# Altium schematic sheet Final_PCBDesign_HY.SchDoc
size A4; SheetNumber: 1; SheetTotal: 1
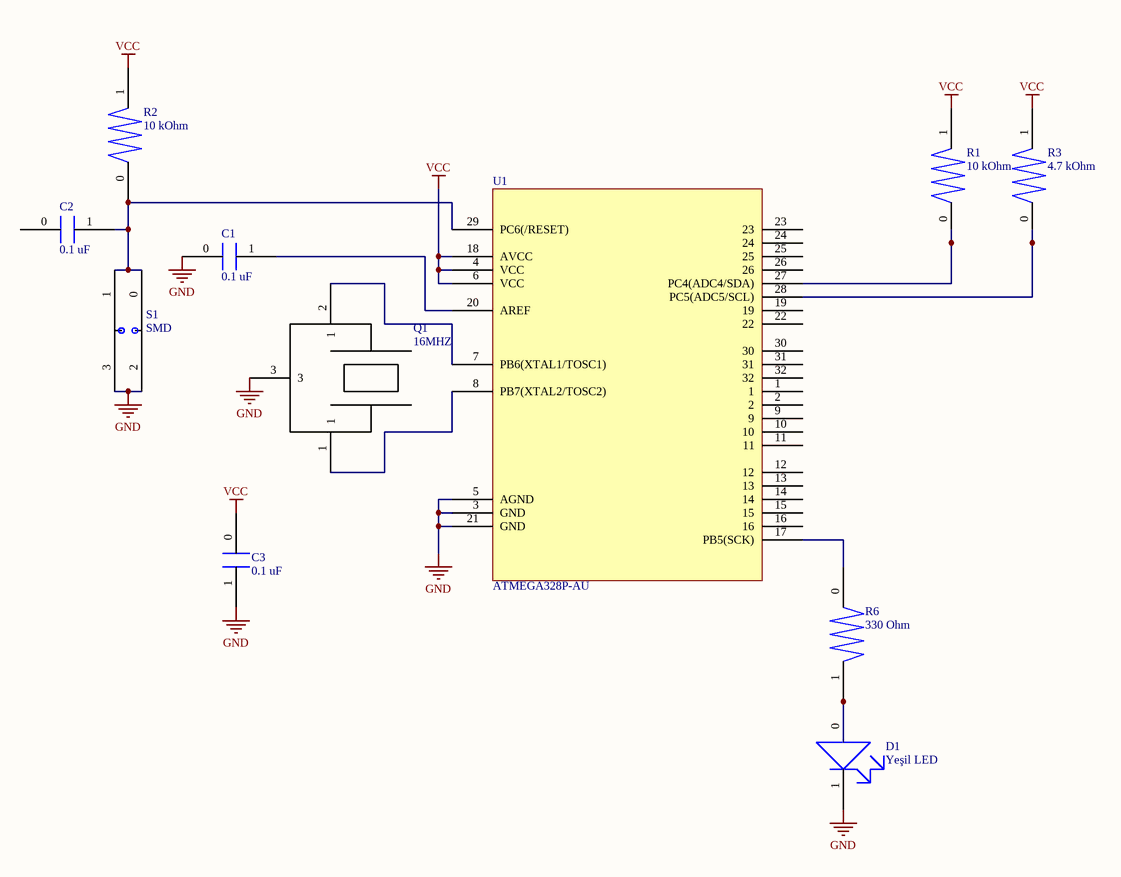
[diagram p0: Final_PCBDesign_HY.SchDoc]

## Parts
C1  0.1 uF  [C_0603 (1608 Metric)]
C2  0.1 uF  [C_0603 (1608 Metric)]
C3  0.1 uF  [C_0603 (1608 Metric)]
D1  Yeşil LED  [D_0603 (1608 Metric)]
Q1  16MHZ  [Q_3-SMD]
R1  10 kOhm  [R_0603]
R2  10 kOhm  [R_0603]
R3  4.7 kOhm  [0603 (1608 Metric)_2]
R6  330 Ohm  [R_0603 (1608 Metric)]
S1  SMD  [EVQ-P7L01P]
U1  ATMEGA328P-AU  [U_32-TQFP]

## Nets
GND: C1.0 C3.1 D1.1 Q1.3 S1.2 S1.3 U1.3(GND) U1.5(AGND) U1.21(GND)
VCC: C3.0 R1.1 R2.1 R3.1 U1.4(VCC) U1.6(VCC) U1.18(AVCC)
NetC1_1: C1.1 U1.20(AREF)
NetC2_1: C2.1 R2.0 S1.0 S1.1 U1.29(PC6(/RESET))
NetD1_0: D1.0 R6.1
NetQ1_1: Q1.1 U1.8(PB7(XTAL2/TOSC2))
NetQ1_2: Q1.2(1) U1.7(PB6(XTAL1/TOSC1))
NetR1_0: R1.0 U1.27(PC4(ADC4/SDA))
NetR3_0: R3.0 U1.28(PC5(ADC5/SCL))
NetR6_0: R6.0 U1.17(PB5(SCK))

Not connected (* = marked no-connect by the designer): C2 0; U1 1 2 9 10 11 12 13 14 15 16 19 22 23 24 25 26 30 31 32

## Library data of the parts
C1-C3 = CL10B104KB8NNNC: Multi Layer Ceramic Capacitor (MLCC) / Cap Ceramic 0.1uF 50V X7R 10% Pad SMD 0603 125°C T/R; Manufacturer: Samsung Electro-Mechanics; Value: 100nF; Supplier: Future Electronics; Supplier Part Number: CL10B104KB8NNNC; Manufacturer Part Number: CL10B104KB8NNNC; RoHS: Compliant; Category: Ceramic Capacitors; Stock: 68984000; Pricing: 8000=0,0023, 20000=0,0022, 80000=0,0021, 200000=0,0021, 500000=0,002 (USD); Case/Package: 0603; Case Code (Imperial): 0603; Case Code (Metric): 1608; China RoHS: Compliant; Contact Plating: Tin; Depth: 800µm; Dielectric: X7R; Dielectric Material: Ceramic; Height: 900µm; Lead Free: Lead Free; Length: 1.6mm; Lifecycle Status: Production; Material: Ceramic; Max Operating Temperature: 125°C; Min Operating Temperature: -55°C; Mounting Technology: Surface Mount; Number of Terminals: 2; Radiation Hardening: No; REACH SVHC: Yes; Schedule B: 8532240020, 8532240020|8532240020|8532240020|8532240020|8532240020|8532240020|8532240020|8532240020|8532240020|8532240020, 8532240020|8532240020|8532240020|8532240020|8532240020|8532240020|8532240020|8532240020|8532240020|8532240020|8532240020, 8532240020|8532240020|8532240020|8532240020|8532240020|8532240020|8532240020|8532240020|8532240020|8532240020|8532240020|8532240020; Thickness: 889µm; Tolerance: 10%; Voltage: 50V; Voltage Rating: 50V; Voltage Rating (DC): 50V; Width: 800µm; ComponentLink1URL: https://datasheet.octopart.com:443/CL10B104KB8NNNC-Samsung-datasheet-165517828.pdf?src-supplier=Upverter; ComponentLink1Description: https://datasheet.octopart.com:443/CL10B104KB8NNNC-Samsung-datasheet-165517828.pdf?src-supplier=Upverter; ComponentLink2URL: https://datasheet.octopart.com:443/CL10B104KB8NNNC-Samsung-Electro-Mechanics-datasheet-116890969.pdf?src-supplier=Upverter; ComponentLink2Description: https://datasheet.octopart.com:443/CL10B104KB8NNNC-Samsung-Electro-Mechanics-datasheet-116890969.pdf?src-supplier=Upverter; ComponentLink3URL: https://datasheet.octopart.com:443/CL10B104KB8NNNC-Samsung-Electro-Mechanics-datasheet-81461840.pdf?src-supplier=Upverter; ComponentLink3Description: https://datasheet.octopart.com:443/CL10B104KB8NNNC-Samsung-Electro-Mechanics-datasheet-81461840.pdf?src-supplier=Upverter; ComponentLink4URL: https://datasheet.octopart.com:443/CL10B104KB8NNNC-Samsung-Electro-Mechanics-datasheet-181551448.pdf?src-supplier=Newark; ComponentLink4Description: https://datasheet.octopart.com:443/CL10B104KB8NNNC-Samsung-Electro-Mechanics-datasheet-181551448.pdf?src-supplier=Newark; ComponentLink5URL: https://datasheet.octopart.com:443/CL10B104KB8NNNC-Samsung-Electro-Mechanics-datasheet-181551449.pdf?src-supplier=Newark; ComponentLink5Description: https://datasheet.octopart.com:443/CL10B104KB8NNNC-Samsung-Electro-Mechanics-datasheet-181551449.pdf?src-supplier=Newark; ComponentLink6URL: https://datasheet.octopart.com/CL10B104KB8NNNC-Samsung-Electro-Mechanics-datasheet-8324245.pdf; ComponentLink6Description: https://datasheet.octopart.com/CL10B104KB8NNNC-Samsung-Electro-Mechanics-datasheet-8324245.pdf; ComponentLink7URL: https://datasheet.octopart.com/CL10B104KB8NNNC-Samsung-Electro-Mechanics-datasheet-97040617.pdf; ComponentLink7Description: https://datasheet.octopart.com/CL10B104KB8NNNC-Samsung-Electro-Mechanics-datasheet-97040617.pdf; ComponentLink8URL: https://datasheet.octopart.com:443/CL10B104KB8NNNC-Samsung-Electro-Mechanics-datasheet-136482302.pdf?src-supplier=Samsung+SCT; ComponentLink8Description: https://datasheet.octopart.com:443/CL10B104KB8NNNC-Samsung-Electro-Mechanics-datasheet-136482302.pdf?src-supplier=Samsung+SCT; ComponentLink9URL: https://datasheet.octopart.com:443/CL10B104KB8NNNC-Samsung-datasheet-42770373.pdf?src-supplier=Future+Electronics; ComponentLink9Description: https://datasheet.octopart.com:443/CL10B104KB8NNNC-Samsung-datasheet-42770373.pdf?src-supplier=Future+Electronics; ComponentLink10URL: https://datasheet.octopart.com:443/CL10B104KB8NNNC-Samsung-datasheet-26589154.pdf?src-supplier=Future+Electronics; ComponentLink10Description: https://datasheet.octopart.com:443/CL10B104KB8NNNC-Samsung-datasheet-26589154.pdf?src-supplier=Future+Electronics; ComponentLink11URL: https://datasheet.octopart.com:443/CL10B104KB8NNNC-Samsung-Electro-Mechanics-datasheet-149136784.pdf?src-supplier=Future+Electronics; ComponentLink11Description: https://datasheet.octopart.com:443/CL10B104KB8NNNC-Samsung-Electro-Mechanics-datasheet-149136784.pdf?src-supplier=Future+Electronics; ComponentLink12URL: https://datasheet.octopart.com:443/CL10B104KB8NNNC-Samsung-datasheet-22147433.pdf?src-supplier=TME; ComponentLink12Description: https://datasheet.octopart.com:443/CL10B104KB8NNNC-Samsung-datasheet-22147433.pdf?src-supplier=TME; ComponentLink13URL: https://datasheet.octopart.com:443/CL10B104KB8NNNC-Samsung-Electro-Mechanics-datasheet-11837008.pdf?src-supplier=Arrow+Electronics; ComponentLink13Description: https://datasheet.octopart.com:443/CL10B104KB8NNNC-Samsung-Electro-Mechanics-datasheet-11837008.pdf?src-supplier=Arrow+Electronics
D1 = LTST-C190KGKT: LED yellow green 0603 wavelength 567.5nm~576.5nm light intensity 18mcd~71mcd Front Mounting; Manufacturer: Diodes Inc.; Dominant Wavelength: 571nm; Forward Current: 30mA; Forward Voltage: 2.4V; Lens Color: Clear, Colorless; Lens Style: Clear; Luminous Intensity: 35mcd; Number of Circuits: 1; Peak Wavelength: 574nm; Power Dissipation: 75mW; Reverse Voltage: 5V; Shape: Rectangular; Test Current: 20mA; Viewing Angle: 130°; Supplier: Arrow Electronics; Supplier Part Number: LTST-C190KGKT; Manufacturer Part Number: LTST-C190KGKT; RoHS: Compliant; Category: LEDs; Stock: 508000; Pricing: 4000=0,0157, 8000=0,0153, 12000=0,0151, 20000=0,0148, 28000=0,0146, 40000=0,0144 (USD); Case/Package: 0603; Case Code (Imperial): 0603; Case Code (Metric): 1608; China RoHS: Compliant; Color: Green; Depth: 800µm; Height: 800µm; Illumination Color: Green; Lead Free: Lead Free; Length: 1.6mm; Lens Transparency: Clear; Lifecycle Status: Production; Max Operating Temperature: 85°C; Min Operating Temperature: -30°C; Mounting Technology: Surface Mount; Number of Elements: 1; Number of LEDs: 1; Pins: 2; Number of Terminals: 2; Power Rating: 75mW; Radiation Hardening: No; REACH SVHC: Yes; Schedule B: 8541402000, 8541402000|8541402000|8541402000|8541402000|8541402000|8541402000|8541402000|8541402000|8541402000|8541402000|8541402000|8541402000|8541402000|8541402000|8541402000|8541402000|8541402000|8541402000|8541402000|8541402000|8541402000|8541402000|8541402000|85; Terminal Pitch: 1.5mm; Wavelength: 574nm; Width: 800µm; ComponentLink1URL: https://datasheet.octopart.com:443/LTST-C190KGKT-Lite-On-datasheet-86397316.pdf?src-supplier=ODG+(Origin+Data+Global); ComponentLink1Description: https://datasheet.octopart.com:443/LTST-C190KGKT-Lite-On-datasheet-86397316.pdf?src-supplier=ODG+(Origin+Data+Global); ComponentLink2URL: https://datasheet.octopart.com:443/LTST-C190KGKT-Lite-On-datasheet-180605179.pdf?src-supplier=IHS; ComponentLink2Description: https://datasheet.octopart.com:443/LTST-C190KGKT-Lite-On-datasheet-180605179.pdf?src-supplier=IHS; ComponentLink3URL: https://datasheet.octopart.com:443/LTST-C190KGKT-Lite-On-datasheet-13693967.pdf?src-supplier=Factory+Futures; ComponentLink3Description: https://datasheet.octopart.com:443/LTST-C190KGKT-Lite-On-datasheet-13693967.pdf?src-supplier=Factory+Futures; ComponentLink4URL: https://datasheet.octopart.com:443/LTST-C190KGKT-Lite-On-datasheet-165573809.pdf?src-supplier=TME; ComponentLink4Description: https://datasheet.octopart.com:443/LTST-C190KGKT-Lite-On-datasheet-165573809.pdf?src-supplier=TME; ComponentLink5URL: https://datasheet.octopart.com:443/LTST-C190KGKT-Lite-On-datasheet-165573808.pdf?src-supplier=TME; ComponentLink5Description: https://datasheet.octopart.com:443/LTST-C190KGKT-Lite-On-datasheet-165573808.pdf?src-supplier=TME; ComponentLink6URL: https://datasheet.octopart.com:443/LTST-C190KGKT-Lite-On-datasheet-43775815.pdf?src-supplier=TME; ComponentLink6Description: https://datasheet.octopart.com:443/LTST-C190KGKT-Lite-On-datasheet-43775815.pdf?src-supplier=TME; ComponentLink7URL: https://datasheet.octopart.com:443/LTST-C190KGKT-Lite-On-datasheet-32046999.pdf?src-supplier=Future+Electronics; ComponentLink7Description: https://datasheet.octopart.com:443/LTST-C190KGKT-Lite-On-datasheet-32046999.pdf?src-supplier=Future+Electronics; ComponentLink8URL: https://datasheet.octopart.com:443/LTST-C190KGKT-Lite-On-datasheet-8326678.pdf?src-supplier=Future+Electronics; ComponentLink8Description: https://datasheet.octopart.com:443/LTST-C190KGKT-Lite-On-datasheet-8326678.pdf?src-supplier=Future+Electronics; ComponentLink9URL: https://datasheet.octopart.com:443/LTST-C190KGKT-Lite-On-datasheet-78838574.pdf?src-supplier=Future+Electronics; ComponentLink9Description: https://datasheet.octopart.com:443/LTST-C190KGKT-Lite-On-datasheet-78838574.pdf?src-supplier=Future+Electronics; ComponentLink10URL: https://datasheet.octopart.com:443/LTST-C190KGKT-Lite-On-datasheet-158288.pdf?src-supplier=Mouser; ComponentLink10Description: https://datasheet.octopart.com:443/LTST-C190KGKT-Lite-On-datasheet-158288.pdf?src-supplier=Mouser; ComponentLink11URL: https://datasheet.octopart.com:443/LTST-C190KGKT-Lite-On-datasheet-49281.pdf?src-supplier=DigiKey; ComponentLink11Description: https://datasheet.octopart.com:443/LTST-C190KGKT-Lite-On-datasheet-49281.pdf?src-supplier=DigiKey; ComponentLink12URL: https://datasheet.octopart.com:443/LTST-C190KGKT-Lite-On-datasheet-14174998.pdf?src-supplier=iiiC; ComponentLink12Description: https://datasheet.octopart.com:443/LTST-C190KGKT-Lite-On-datasheet-14174998.pdf?src-supplier=iiiC
Q1 = CSTCE16M0V53-R0: Ceramic Resonator 16MHz ±0.5% (Tol) ±0.3% (Stability) 15pF 40Ohm 3-Pin CSMD T/R; Manufacturer: Murata; Frequency Stability: 5000ppm; Impedance: 40Ω; Supplier: Farnell; Supplier Part Number: CSTCE16M0V53-R0; Manufacturer Part Number: CSTCE16M0V53-R0; RoHS: Compliant; Category: Capacitors; Pricing: 5=0,458, 50=0,304, 250=0,277, 500=0,227, 1500=0,212, 3000=0,197, 15000=0,191 (EUR); Value: 15pF; Case/Package: SMD/SMT; Composition: Ceramic; Contact Plating: Gold; Frequency: 16MHz; Frequency Tolerance: 0.5%; Height: 990.6µm; Lead Free: Lead Free; Length: 3.2004mm; Lifecycle Status: Obsolete; Load Capacitance: 15pF; Max Operating Temperature: 85°C; Min Operating Temperature: -45°C; Pins: 3; REACH SVHC: Yes; Self Resonant Frequency: 16MHz; Termination: SMD/SMT; Tolerance: 0.5%; Width: 1.2954mm; ComponentLink1URL: https://datasheet.octopart.com:443/CSTCE16M0V53-R0-Murata-datasheet-180807744.pdf?src-supplier=IHS; ComponentLink1Description: https://datasheet.octopart.com:443/CSTCE16M0V53-R0-Murata-datasheet-180807744.pdf?src-supplier=IHS; ComponentLink2URL: https://datasheet.octopart.com:443/CSTCE16M0V53-R0-Murata-datasheet-13544362.pdf?src-supplier=Upverter; ComponentLink2Description: https://datasheet.octopart.com:443/CSTCE16M0V53-R0-Murata-datasheet-13544362.pdf?src-supplier=Upverter; ComponentLink3URL: https://datasheet.octopart.com:443/CSTCE16M0V53-R0-Murata-datasheet-12524911.pdf?src-supplier=Upverter; ComponentLink3Description: https://datasheet.octopart.com:443/CSTCE16M0V53-R0-Murata-datasheet-12524911.pdf?src-supplier=Upverter; ComponentLink4URL: https://datasheet.octopart.com:443/CSTCE16M0V53-R0-Murata-datasheet-62316101.pdf?src-supplier=Upverter; ComponentLink4Description: https://datasheet.octopart.com:443/CSTCE16M0V53-R0-Murata-datasheet-62316101.pdf?src-supplier=Upverter; ComponentLink5URL: https://datasheet.octopart.com:443/CSTCE16M0V53-R0-Murata-datasheet-141913778.pdf?src-supplier=Upverter; ComponentLink5Description: https://datasheet.octopart.com:443/CSTCE16M0V53-R0-Murata-datasheet-141913778.pdf?src-supplier=Upverter; ComponentLink6URL: https://datasheet.octopart.com:443/CSTCE16M0V53-R0-Murata-datasheet-5335552.pdf?src-supplier=Newark; ComponentLink6Description: https://datasheet.octopart.com:443/CSTCE16M0V53-R0-Murata-datasheet-5335552.pdf?src-supplier=Newark; ComponentLink7URL: https://datasheet.octopart.com:443/CSTCE16M0V53-R0-Murata-datasheet-162930.pdf?src-supplier=Future+Electronics; ComponentLink7Description: https://datasheet.octopart.com:443/CSTCE16M0V53-R0-Murata-datasheet-162930.pdf?src-supplier=Future+Electronics; ComponentLink8URL: https://datasheet.octopart.com:443/CSTCE16M0V53-R0-Murata-datasheet-10541638.pdf?src-supplier=Future+Electronics; ComponentLink8Description: https://datasheet.octopart.com:443/CSTCE16M0V53-R0-Murata-datasheet-10541638.pdf?src-supplier=Future+Electronics; ComponentLink9URL: https://datasheet.octopart.com:443/CSTCE16M0V53-R0-Murata-datasheet-141258340.pdf?src-supplier=Ciiva; ComponentLink9Description: https://datasheet.octopart.com:443/CSTCE16M0V53-R0-Murata-datasheet-141258340.pdf?src-supplier=Ciiva; ComponentLink10URL: https://datasheet.octopart.com:443/CSTCE16M0V53-R0-Murata-datasheet-138707999.pdf?src-supplier=Ciiva; ComponentLink10Description: https://datasheet.octopart.com:443/CSTCE16M0V53-R0-Murata-datasheet-138707999.pdf?src-supplier=Ciiva; ComponentLink11URL: https://datasheet.octopart.com:443/CSTCE16M0V53-R0-Murata-datasheet-83054217.pdf?src-supplier=TME; ComponentLink11Description: https://datasheet.octopart.com:443/CSTCE16M0V53-R0-Murata-datasheet-83054217.pdf?src-supplier=TME; ComponentLink12URL: https://datasheet.octopart.com/CSTCE16M0V53-R0-Murata-datasheet-86813623.pdf; ComponentLink12Description: https://datasheet.octopart.com/CSTCE16M0V53-R0-Murata-datasheet-86813623.pdf; ComponentLink13URL: https://datasheet.octopart.com:443/CSTCE16M0V53-R0-Murata-datasheet-13536434.pdf?src-supplier=Factory+Futures; ComponentLink13Description: https://datasheet.octopart.com:443/CSTCE16M0V53-R0-Murata-datasheet-13536434.pdf?src-supplier=Factory+Futures; ComponentLink14URL: https://datasheet.octopart.com:443/CSTCE16M0V53-R0-Murata-datasheet-11793933.pdf?src-supplier=Arrow+Electronics; ComponentLink14Description: https://datasheet.octopart.com:443/CSTCE16M0V53-R0-Murata-datasheet-11793933.pdf?src-supplier=Arrow+Electronics; ComponentLink15URL: https://datasheet.octopart.com:443/CSTCE16M0V53-R0-Murata-datasheet-15574.pdf?src-supplier=element14+APAC; ComponentLink15Description: https://datasheet.octopart.com:443/CSTCE16M0V53-R0-Murata-datasheet-15574.pdf?src-supplier=element14+APAC; ComponentLink16URL: https://datasheet.octopart.com:443/CSTCE16M0V53-R0-Murata-datasheet-119166.pdf?src-supplier=DigiKey; ComponentLink16Description: https://datasheet.octopart.com:443/CSTCE16M0V53-R0-Murata-datasheet-119166.pdf?src-supplier=DigiKey; ComponentLink17URL: http://sigma.octopart.com:80/reach_statement/Murata-company-16.pdf?src-supplier=Compliance+Statements; ComponentLink17Description: http://sigma.octopart.com:80/reach_statement/Murata-company-16.pdf?src-supplier=Compliance+Statements
R1 R2 = RC0603FR-0710KL: 100mW Thick Film Resistors ±100ppm/℃ ±1% 10kΩ 0603 Chip Resistor - Surface Mount ROHS; Manufacturer: Yageo Group; Temperature Coefficient: 100ppm/°C; Voltage Rating: 75V; Voltage Rating (DC): 50V; Supplier: Farnell; Supplier Part Number: RC0603FR-0710KL; Manufacturer Part Number: RC0603FR-0710KL; RoHS: Compliant; Category: Chip SMD Resistors; Stock: 11228000; Pricing: 5000=0,0037 (EUR); Case/Package: 0603; Case Code (Imperial): 0603; Case Code (Metric): 0603; China RoHS: Non-Compliant; Composition: Thick Film; Contact Plating: Tin; Depth: 800µm; Height: 450µm; Lead Free: Lead Free; Lead Pitch: 300µm; Length: 1.6mm; Lifecycle Status: Production; Max Operating Temperature: 155°C; Military Standard: Not; Min Operating Temperature: -55°C; Mounting Technology: Surface Mount; Pins: 2; Number of Terminals: 2; Packaging: Tape & Reel; Power Rating: 100mW; Radiation Hardening: No; REACH SVHC: Yes; Value: 10kΩ; Schedule B: 8533210045, 8533210045|8533210045|8533210045|8533210045|8533210045|8533210045|8533210045|8533210045|8533210045|8533210045|8533210045|8533210045|8533210045|8533210045|8533210045|8533210045|8533210045|8533210045|8533210045|8533210045|8533210045|8533210045|8533210045|85; Termination: SMD/SMT; Tolerance: 1%; Weight: 2.012816mg; Width: 800µm; Working Voltage: 75V; ComponentLink1URL: https://datasheet.octopart.com:443/RC0603FR-0710KL-Yageo-datasheet-175887523.pdf?src-supplier=IHS; ComponentLink1Description: https://datasheet.octopart.com:443/RC0603FR-0710KL-Yageo-datasheet-175887523.pdf?src-supplier=IHS; ComponentLink2URL: https://datasheet.octopart.com:443/RC0603FR-0710KL-Yageo-datasheet-103092701.pdf?src-supplier=Upverter; ComponentLink2Description: https://datasheet.octopart.com:443/RC0603FR-0710KL-Yageo-datasheet-103092701.pdf?src-supplier=Upverter; ComponentLink3URL: https://datasheet.octopart.com:443/RC0603FR-0710KL-Yageo-datasheet-98239111.pdf?src-supplier=Upverter; ComponentLink3Description: https://datasheet.octopart.com:443/RC0603FR-0710KL-Yageo-datasheet-98239111.pdf?src-supplier=Upverter; ComponentLink4URL: https://datasheet.octopart.com:443/RC0603FR-0710KL-Yageo-datasheet-141265859.pdf?src-supplier=Upverter; ComponentLink4Description: https://datasheet.octopart.com:443/RC0603FR-0710KL-Yageo-datasheet-141265859.pdf?src-supplier=Upverter; ComponentLink5URL: https://sigma.octopart.com:443/138820526/technical_drawing/Yageo-RC0603FR-0710KL.pdf?src-supplier=Upverter; ComponentLink5Description: https://sigma.octopart.com:443/138820526/technical_drawing/Yageo-RC0603FR-0710KL.pdf?src-supplier=Upverter; ComponentLink6URL: https://datasheet.octopart.com:443/RC0603FR-0710KL-Yageo-datasheet-8328172.pdf?src-supplier=Farnell; ComponentLink6Description: https://datasheet.octopart.com:443/RC0603FR-0710KL-Yageo-datasheet-8328172.pdf?src-supplier=Farnell; ComponentLink7URL: https://datasheet.octopart.com:443/RC0603FR-0710KL-Yageo-datasheet-13691069.pdf?src-supplier=Farnell; ComponentLink7Description: https://datasheet.octopart.com:443/RC0603FR-0710KL-Yageo-datasheet-13691069.pdf?src-supplier=Farnell; ComponentLink8URL: https://datasheet.octopart.com:443/RC0603FR-0710KL-Yageo-datasheet-62067350.pdf?src-supplier=element14+APAC; ComponentLink8Description: https://datasheet.octopart.com:443/RC0603FR-0710KL-Yageo-datasheet-62067350.pdf?src-supplier=element14+APAC; ComponentLink9URL: https://datasheet.octopart.com:443/RC0603FR-0710KL-Yageo-datasheet-17842380.pdf?src-supplier=element14+APAC; ComponentLink9Description: https://datasheet.octopart.com:443/RC0603FR-0710KL-Yageo-datasheet-17842380.pdf?src-supplier=element14+APAC; ComponentLink10URL: https://datasheet.octopart.com:443/RC0603FR-0710KL-Yageo-datasheet-15599030.pdf?src-supplier=Future+Electronics; ComponentLink10Description: https://datasheet.octopart.com:443/RC0603FR-0710KL-Yageo-datasheet-15599030.pdf?src-supplier=Future+Electronics; ComponentLink11URL: https://datasheet.octopart.com:443/RC0603FR-0710KL-Yageo-Group-datasheet-176638170.pdf?src-supplier=Future+Electronics; ComponentLink11Description: https://datasheet.octopart.com:443/RC0603FR-0710KL-Yageo-Group-datasheet-176638170.pdf?src-supplier=Future+Electronics; ComponentLink12URL: https://datasheet.octopart.com:443/RC0603FR-0710KL-Yageo-datasheet-164759695.pdf?src-supplier=Future+Electronics; ComponentLink12Description: https://datasheet.octopart.com:443/RC0603FR-0710KL-Yageo-datasheet-164759695.pdf?src-supplier=Future+Electronics; ComponentLink13URL: https://datasheet.octopart.com:443/RC0603FR-0710KL-Yageo-datasheet-127823281.pdf?src-supplier=Future+Electronics; ComponentLink13Description: https://datasheet.octopart.com:443/RC0603FR-0710KL-Yageo-datasheet-127823281.pdf?src-supplier=Future+Electronics; ComponentLink14URL: https://datasheet.octopart.com:443/RC0603FR-0710KL-Yageo-datasheet-137700087.pdf?src-supplier=Future+Electronics; ComponentLink14Description: https://datasheet.octopart.com:443/RC0603FR-0710KL-Yageo-datasheet-137700087.pdf?src-supplier=Future+Electronics; ComponentLink15URL: https://datasheet.octopart.com:443/RC0603FR-0710KL-Yageo-datasheet-27584510.pdf?src-supplier=Future+Electronics; ComponentLink15Description: https://datasheet.octopart.com:443/RC0603FR-0710KL-Yageo-datasheet-27584510.pdf?src-supplier=Future+Electronics; ComponentLink16URL: https://datasheet.octopart.com:443/RC0603FR-0710KL-Yageo-datasheet-8324193.pdf?src-supplier=Future+Electronics; ComponentLink16Description: https://datasheet.octopart.com:443/RC0603FR-0710KL-Yageo-datasheet-8324193.pdf?src-supplier=Future+Electronics; ComponentLink17URL: https://datasheet.octopart.com:443/RC0603FR-0710KL-Yageo-datasheet-12596169.pdf?src-supplier=Newark; ComponentLink17Description: https://datasheet.octopart.com:443/RC0603FR-0710KL-Yageo-datasheet-12596169.pdf?src-supplier=Newark; ComponentLink18URL: https://datasheet.octopart.com:443/RC0603FR-0710KL-Yageo-datasheet-503470.pdf?src-supplier=Newark; ComponentLink18Description: https://datasheet.octopart.com:443/RC0603FR-0710KL-Yageo-datasheet-503470.pdf?src-supplier=Newark; ComponentLink19URL: https://datasheet.octopart.com:443/RC0603FR-0710KL-Yageo-datasheet-34211833.pdf?src-supplier=Newark; ComponentLink19Description: https://datasheet.octopart.com:443/RC0603FR-0710KL-Yageo-datasheet-34211833.pdf?src-supplier=Newark; ComponentLink20URL: https://datasheet.octopart.com:443/RC0603FR-0710KL-Yageo-datasheet-79472498.pdf?src-supplier=Megastar; ComponentLink20Description: https://datasheet.octopart.com:443/RC0603FR-0710KL-Yageo-datasheet-79472498.pdf?src-supplier=Megastar; ComponentLink21URL: https://datasheet.octopart.com/RC0603FR-0710KL-Yageo-datasheet-73766026.pdf; ComponentLink21Description: https://datasheet.octopart.com/RC0603FR-0710KL-Yageo-datasheet-73766026.pdf; ComponentLink22URL: https://datasheet.octopart.com:443/RC0603FR-0710KL-Yageo-datasheet-118562.pdf?src-supplier=DigiKey; ComponentLink22Description: https://datasheet.octopart.com:443/RC0603FR-0710KL-Yageo-datasheet-118562.pdf?src-supplier=DigiKey; ComponentLink23URL: http://sigma.octopart.com:80/conflict_mineral_statement/Yageo-company-3.pdf?src-supplier=Compliance+Statements; ComponentLink23Description: http://sigma.octopart.com:80/conflict_mineral_statement/Yageo-company-3.pdf?src-supplier=Compliance+Statements; ComponentLink24URL: http://sigma.octopart.com:80/rohs_statement/Yageo-company-2.pdf?src-supplier=Compliance+Statements; ComponentLink24Description: http://sigma.octopart.com:80/rohs_statement/Yageo-company-2.pdf?src-supplier=Compliance+Statements
R3 = RC0603FR-074K7L: Yageo RC0603FR-074K7L Resistor 0603 SMD 4.7k Ohm 1% 100mW Thick Film; Manufacturer: Yageo Group; Value: 4.7kΩ; Temperature Coefficient: 100ppm/°C; Voltage Rating: 75V; Voltage Rating (DC): 50V; Supplier: Farnell; Supplier Part Number: RC0603FR-074K7L; Manufacturer Part Number: RC0603FR-074K7L; RoHS: Compliant; Category: Chip SMD Resistors; Stock: 357436; Pricing: 10=0,0058, 100=0,0052, 500=0,0047, 1000=0,0042, 2500=0,0036, 5000=0,0031 (EUR); Case/Package: 0603; Case Code (Imperial): 0603; China RoHS: Non-Compliant; Composition: Thick Film; Contact Plating: Tin; Country of Origin: Mainland China, Taiwan; Depth: 800µm; Export Control Classification Number (ECCN) Code: EAR99; Height: 450µm; Harmonized Tariff Schedule (HTS) Code: 8533.21.00.30; Introduction Date: 2004-09-22; Lead Free: Lead Free; Lead Pitch: 300µm; Length: 1.6mm; Lifecycle Status: Production; Max Operating Temperature: 155°C; Military Standard: Not; Min Operating Temperature: -55°C; Mounting Technology: Surface Mount; Pins: 2; Number of Terminals: 2; Packaging: Tape & Reel; Power Rating: 100mW; Radiation Hardening: No; REACH SVHC: Yes; Schedule B: 8533210045, 8533210045|8533210045|8533210045|8533210045|8533210045|8533210045|8533210045|8533210045|8533210045|8533210045|8533210045|8533210045|8533210045|8533210045|8533210045|8533210045|8533210045|8533210045|8533210045|8533210045|8533210045|8533210045|8533210045|85; Termination: SMD/SMT; Tolerance: 1%; Width: 800µm; Working Voltage: 75V; ComponentLink1URL: https://datasheet.octopart.com:443/RC0603FR-074K7L-Yageo-datasheet-175887523.pdf?src-supplier=IHS; ComponentLink1Description: https://datasheet.octopart.com:443/RC0603FR-074K7L-Yageo-datasheet-175887523.pdf?src-supplier=IHS; ComponentLink2URL: https://datasheet.octopart.com:443/RC0603FR-074K7L-Yageo-datasheet-103092701.pdf?src-supplier=Upverter; ComponentLink2Description: https://datasheet.octopart.com:443/RC0603FR-074K7L-Yageo-datasheet-103092701.pdf?src-supplier=Upverter; ComponentLink3URL: https://datasheet.octopart.com:443/RC0603FR-074K7L-Yageo-datasheet-8328172.pdf?src-supplier=Farnell; ComponentLink3Description: https://datasheet.octopart.com:443/RC0603FR-074K7L-Yageo-datasheet-8328172.pdf?src-supplier=Farnell; ComponentLink4URL: https://datasheet.octopart.com:443/RC0603FR-074K7L-Yageo-datasheet-13691069.pdf?src-supplier=Farnell; ComponentLink4Description: https://datasheet.octopart.com:443/RC0603FR-074K7L-Yageo-datasheet-13691069.pdf?src-supplier=Farnell; ComponentLink5URL: https://datasheet.octopart.com:443/RC0603FR-074K7L-Yageo-Group-datasheet-190305687.pdf?src-supplier=Future+Electronics; ComponentLink5Description: https://datasheet.octopart.com:443/RC0603FR-074K7L-Yageo-Group-datasheet-190305687.pdf?src-supplier=Future+Electronics; ComponentLink6URL: https://datasheet.octopart.com:443/RC0603FR-074K7L-Yageo-datasheet-164759695.pdf?src-supplier=Future+Electronics; ComponentLink6Description: https://datasheet.octopart.com:443/RC0603FR-074K7L-Yageo-datasheet-164759695.pdf?src-supplier=Future+Electronics; ComponentLink7URL: https://datasheet.octopart.com:443/RC0603FR-074K7L-Yageo-datasheet-137700087.pdf?src-supplier=Future+Electronics; ComponentLink7Description: https://datasheet.octopart.com:443/RC0603FR-074K7L-Yageo-datasheet-137700087.pdf?src-supplier=Future+Electronics; ComponentLink8URL: https://datasheet.octopart.com:443/RC0603FR074K7L-Yageo-datasheet-27584510.pdf?src-supplier=Future+Electronics; ComponentLink8Description: https://datasheet.octopart.com:443/RC0603FR074K7L-Yageo-datasheet-27584510.pdf?src-supplier=Future+Electronics; ComponentLink9URL: https://datasheet.octopart.com:443/RC0603FR-074K7L-Yageo-datasheet-15599030.pdf?src-supplier=Future+Electronics; ComponentLink9Description: https://datasheet.octopart.com:443/RC0603FR-074K7L-Yageo-datasheet-15599030.pdf?src-supplier=Future+Electronics; ComponentLink10URL: https://datasheet.octopart.com:443/RC0603FR-074K7L-Yageo-datasheet-175423674.pdf?src-supplier=Newark; ComponentLink10Description: https://datasheet.octopart.com:443/RC0603FR-074K7L-Yageo-datasheet-175423674.pdf?src-supplier=Newark; ComponentLink11URL: https://datasheet.octopart.com:443/RC0603FR-074K7L-Yageo-datasheet-12596169.pdf?src-supplier=Newark; ComponentLink11Description: https://datasheet.octopart.com:443/RC0603FR-074K7L-Yageo-datasheet-12596169.pdf?src-supplier=Newark; ComponentLink12URL: https://datasheet.octopart.com:443/RC0603FR-074K7L-Yageo-datasheet-503470.pdf?src-supplier=Newark; ComponentLink12Description: https://datasheet.octopart.com:443/RC0603FR-074K7L-Yageo-datasheet-503470.pdf?src-supplier=Newark; ComponentLink13URL: https://datasheet.octopart.com:443/RC0603FR-074K7L-Yageo-datasheet-34211833.pdf?src-supplier=element14+APAC; ComponentLink13Description: https://datasheet.octopart.com:443/RC0603FR-074K7L-Yageo-datasheet-34211833.pdf?src-supplier=element14+APAC; ComponentLink14URL: https://datasheet.octopart.com:443/RC0603FR-074K7L-Yageo-datasheet-62067350.pdf?src-supplier=element14+APAC; ComponentLink14Description: https://datasheet.octopart.com:443/RC0603FR-074K7L-Yageo-datasheet-62067350.pdf?src-supplier=element14+APAC; ComponentLink15URL: https://datasheet.octopart.com:443/RC0603FR-074K7L-Yageo-datasheet-17842380.pdf?src-supplier=element14+APAC; ComponentLink15Description: https://datasheet.octopart.com:443/RC0603FR-074K7L-Yageo-datasheet-17842380.pdf?src-supplier=element14+APAC; ComponentLink16URL: https://datasheet.octopart.com:443/RC0603FR-074K7L-Yageo-datasheet-79472498.pdf?src-supplier=Megastar; ComponentLink16Description: https://datasheet.octopart.com:443/RC0603FR-074K7L-Yageo-datasheet-79472498.pdf?src-supplier=Megastar; ComponentLink17URL: https://datasheet.octopart.com/RC0603FR-074K7L-Yageo-datasheet-73766026.pdf; ComponentLink17Description: https://datasheet.octopart.com/RC0603FR-074K7L-Yageo-datasheet-73766026.pdf; ComponentLink18URL: https://datasheet.octopart.com:443/RC0603FR-074K7L-Yageo-datasheet-118562.pdf?src-supplier=DigiKey; ComponentLink18Description: https://datasheet.octopart.com:443/RC0603FR-074K7L-Yageo-datasheet-118562.pdf?src-supplier=DigiKey; ComponentLink19URL: http://sigma.octopart.com:80/conflict_mineral_statement/Yageo-company-3.pdf?src-supplier=Compliance+Statements; ComponentLink19Description: http://sigma.octopart.com:80/conflict_mineral_statement/Yageo-company-3.pdf?src-supplier=Compliance+Statements; ComponentLink20URL: http://sigma.octopart.com:80/rohs_statement/Yageo-company-2.pdf?src-supplier=Compliance+Statements; ComponentLink20Description: http://sigma.octopart.com:80/rohs_statement/Yageo-company-2.pdf?src-supplier=Compliance+Statements
R6 = RC0603FR-07330RL: 100mW Thick Film Resistors 75V ±100ppm/℃ ±1% 330Ω 0603 Chip Resistor - Surface Mount ROHS; Manufacturer: Yageo Group; Value: 47µF; ESR (Equivalent Series Resistance): 800mΩ; Temperature Coefficient: 100ppm/°C; Voltage Rating: 16V; Voltage Rating (AC): 50V; Supplier: Farnell; Supplier Part Number: RC0603FR-07330RL; Manufacturer Part Number: RC0603FR-07330RL; RoHS: Compliant; Category: Chip SMD Resistors; Stock: 455830; Pricing: 10=0,0061, 100=0,0052, 500=0,0049, 1000=0,0046, 2500=0,0036 (EUR); Case/Package: 0603; Case Code (Imperial): 2917; Case Code (Metric): 7343; China RoHS: Non-Compliant; Composition: Thick Film; Contact Plating: Tin; Depth: 800µm; Features: Moisture Resistant; Height: 450µm; Lead Free: Lead Free; Length: 1.6mm; Lifecycle Status: Production; Max Operating Temperature: 155°C; Max Power Dissipation: 100mW; Min Operating Temperature: -55°C; Mounting Technology: Surface Mount; Pins: 2; Number of Terminals: 2; Number of Terminations: 2; Packaging: Tape and Reel; Power Rating: 100mW; Radiation Hardening: No; REACH SVHC: Yes; Schedule B: 8533210045, 8533210045|8533210045, 8533210045|8533210045|8533210045, 8533210045|8533210045|8533210045|8533210045; Termination: SMD/SMT; Tolerance: 1%; Voltage Rating (DC): 16V; Width: 800µm; Working Voltage: 75V; ComponentLink1URL: https://datasheet.octopart.com:443/RC0603FR-07330RL-Yageo-datasheet-175887523.pdf?src-supplier=Newark; ComponentLink1Description: https://datasheet.octopart.com:443/RC0603FR-07330RL-Yageo-datasheet-175887523.pdf?src-supplier=Newark; ComponentLink2URL: https://datasheet.octopart.com:443/RC0603FR-07330RL-Yageo-datasheet-62067350.pdf?src-supplier=Newark; ComponentLink2Description: https://datasheet.octopart.com:443/RC0603FR-07330RL-Yageo-datasheet-62067350.pdf?src-supplier=Newark; ComponentLink3URL: https://datasheet.octopart.com:443/RC0603FR-07330RL-Yageo-datasheet-12596169.pdf?src-supplier=Newark; ComponentLink3Description: https://datasheet.octopart.com:443/RC0603FR-07330RL-Yageo-datasheet-12596169.pdf?src-supplier=Newark; ComponentLink4URL: https://datasheet.octopart.com:443/RC0603FR-07330RL-Yageo-datasheet-503470.pdf?src-supplier=Newark; ComponentLink4Description: https://datasheet.octopart.com:443/RC0603FR-07330RL-Yageo-datasheet-503470.pdf?src-supplier=Newark; ComponentLink5URL: https://datasheet.octopart.com:443/RC0603FR-07330RL-Yageo-datasheet-34211833.pdf?src-supplier=Newark; ComponentLink5Description: https://datasheet.octopart.com:443/RC0603FR-07330RL-Yageo-datasheet-34211833.pdf?src-supplier=Newark; ComponentLink6URL: https://datasheet.octopart.com:443/RC0603FR-07330RL-Yageo-datasheet-103092701.pdf?src-supplier=Upverter; ComponentLink6Description: https://datasheet.octopart.com:443/RC0603FR-07330RL-Yageo-datasheet-103092701.pdf?src-supplier=Upverter; ComponentLink7URL: https://datasheet.octopart.com:443/RC0603FR-07330RL-Yageo-datasheet-98239111.pdf?src-supplier=Upverter; ComponentLink7Description: https://datasheet.octopart.com:443/RC0603FR-07330RL-Yageo-datasheet-98239111.pdf?src-supplier=Upverter; ComponentLink8URL: https://datasheet.octopart.com:443/RC0603FR-07330RL-Yageo-datasheet-8328172.pdf?src-supplier=element14+APAC; ComponentLink8Description: https://datasheet.octopart.com:443/RC0603FR-07330RL-Yageo-datasheet-8328172.pdf?src-supplier=element14+APAC; ComponentLink9URL: https://datasheet.octopart.com:443/RC0603FR-07330RL-Yageo-Group-datasheet-190305687.pdf?src-supplier=Future+Electronics; ComponentLink9Description: https://datasheet.octopart.com:443/RC0603FR-07330RL-Yageo-Group-datasheet-190305687.pdf?src-supplier=Future+Electronics; ComponentLink10URL: https://datasheet.octopart.com:443/RC0603FR-07330RL-Yageo-datasheet-15599030.pdf?src-supplier=Future+Electronics; ComponentLink10Description: https://datasheet.octopart.com:443/RC0603FR-07330RL-Yageo-datasheet-15599030.pdf?src-supplier=Future+Electronics; ComponentLink11URL: https://datasheet.octopart.com:443/RC0603FR-07330RL-Yageo-datasheet-164759695.pdf?src-supplier=Future+Electronics; ComponentLink11Description: https://datasheet.octopart.com:443/RC0603FR-07330RL-Yageo-datasheet-164759695.pdf?src-supplier=Future+Electronics; ComponentLink12URL: https://datasheet.octopart.com:443/RC0603FR-07330RL-Yageo-datasheet-137700087.pdf?src-supplier=Future+Electronics; ComponentLink12Description: https://datasheet.octopart.com:443/RC0603FR-07330RL-Yageo-datasheet-137700087.pdf?src-supplier=Future+Electronics; ComponentLink13URL: https://datasheet.octopart.com:443/RC0603FR-07330RL-Yageo-datasheet-27584510.pdf?src-supplier=Future+Electronics; ComponentLink13Description: https://datasheet.octopart.com:443/RC0603FR-07330RL-Yageo-datasheet-27584510.pdf?src-supplier=Future+Electronics; ComponentLink14URL: https://datasheet.octopart.com:443/RC0603FR-07330RL-Yageo-datasheet-8324193.pdf?src-supplier=Future+Electronics; ComponentLink14Description: https://datasheet.octopart.com:443/RC0603FR-07330RL-Yageo-datasheet-8324193.pdf?src-supplier=Future+Electronics; ComponentLink15URL: https://datasheet.octopart.com:443/RC0603FR-07330RL-Yageo-datasheet-79472498.pdf?src-supplier=Megastar; ComponentLink15Description: https://datasheet.octopart.com:443/RC0603FR-07330RL-Yageo-datasheet-79472498.pdf?src-supplier=Megastar; ComponentLink16URL: https://datasheet.octopart.com/RC0603FR-07330RL-Yageo-datasheet-73766026.pdf; ComponentLink16Description: https://datasheet.octopart.com/RC0603FR-07330RL-Yageo-datasheet-73766026.pdf; ComponentLink17URL: https://datasheet.octopart.com:443/RC0603FR-07330RL-Yageo-datasheet-13691069.pdf?src-supplier=Farnell; ComponentLink17Description: https://datasheet.octopart.com:443/RC0603FR-07330RL-Yageo-datasheet-13691069.pdf?src-supplier=Farnell; ComponentLink18URL: https://datasheet.octopart.com:443/RC0603FR-07330RL-Yageo-datasheet-118562.pdf?src-supplier=DigiKey; ComponentLink18Description: https://datasheet.octopart.com:443/RC0603FR-07330RL-Yageo-datasheet-118562.pdf?src-supplier=DigiKey; ComponentLink19URL: http://sigma.octopart.com:80/conflict_mineral_statement/Yageo-company-3.pdf?src-supplier=Compliance+Statements; ComponentLink19Description: http://sigma.octopart.com:80/conflict_mineral_statement/Yageo-company-3.pdf?src-supplier=Compliance+Statements; ComponentLink20URL: http://sigma.octopart.com:80/rohs_statement/Yageo-company-2.pdf?src-supplier=Compliance+Statements; ComponentLink20Description: http://sigma.octopart.com:80/rohs_statement/Yageo-company-2.pdf?src-supplier=Compliance+Statements
S1 = EVQP7L01P: Switch Tactile N.O. SPST Rectangular Button Gull Wing 0.05A 12VDC 1.6N SMD T/R; Manufacturer: Panasonic; Actuator Length: 650µm; Contact Current Rating: 50mA; Contact Resistance: 500mΩ; Electrical Life: 100kcycles; Illumination Type: Non-Illuminated; Insulation Resistance: 100MΩ; Max Voltage Rating (DC): 12V; Number of Positions: 1; Switch Function: Off-Mom; Switch Travel: 200µm; Supplier: Farnell; Supplier Part Number: EVQP7L01P; Manufacturer Part Number: EVQP7L01P; RoHS: Compliant; Category: Tactile Switches; Stock: 3026; Pricing: 10=0,223, 50=0,209, 100=0,187, 500=0,163 (EUR); Case/Package: SMD/SMT; Height: 1.35mm; Lead Free: Lead Free; Length: 3.55mm; Life (Cycles): 100kcycles; Lifecycle Status: Production; Max Current Rating: 50mA; Max Operating Temperature: 70°C; Mechanical Life: 100kcycles; Min Operating Temperature: -20°C; Mounting Technology: Surface Mount; Operating Force: 1.6N; Orientation: Right Angle; Radiation Hardening: No; REACH SVHC: Yes; Termination: Gull Wing; Throw Configuration: SPST; Voltage Rating (DC): 12V; ComponentLink1URL: https://datasheet.octopart.com:443/EVQP7L01P-Panasonic-datasheet-22087671.pdf?src-supplier=Electro+Sonic; ComponentLink1Description: https://datasheet.octopart.com:443/EVQP7L01P-Panasonic-datasheet-22087671.pdf?src-supplier=Electro+Sonic; ComponentLink2URL: https://datasheet.octopart.com:443/EVQP7L01P-Panasonic-datasheet-98950114.pdf?src-supplier=Master+Electronics; ComponentLink2Description: https://datasheet.octopart.com:443/EVQP7L01P-Panasonic-datasheet-98950114.pdf?src-supplier=Master+Electronics; ComponentLink3URL: https://datasheet.octopart.com:443/EVQ-P7L01P-Panasonic-datasheet-13271580.pdf?src-supplier=RS+(Formerly+Allied+Electronics); ComponentLink3Description: https://datasheet.octopart.com:443/EVQ-P7L01P-Panasonic-datasheet-13271580.pdf?src-supplier=RS+(Formerly+Allied+Electronics); ComponentLink4URL: https://datasheet.octopart.com:443/EVQ-P7L01P-Panasonic-datasheet-13280430.pdf?src-supplier=RS+(Formerly+Allied+Electronics); ComponentLink4Description: https://datasheet.octopart.com:443/EVQ-P7L01P-Panasonic-datasheet-13280430.pdf?src-supplier=RS+(Formerly+Allied+Electronics)
U1 = ATMEGA328P-AU: MICROCONTROLLER MCU, 8 BIT, ATMEGA, 20MH; 20MHZ, TQFP-32; Controller Family/Series: ATmega; CPU Speed: 20MHz;; Manufacturer: Microchip; Manufacturer Lifecycle Status: REL; Core Architecture: AVR; Data Bus Width: 8b; Interface: 2-Wire, I2C, SPI, UART, USART; Max Supply Voltage: 5.5V; Memory Size: 32kB; Memory Format: FLASH; Min Supply Voltage: 1.8V; Number of A/D Converters: 1; Number of ADC Channels: 8; Number of I/Os: 23; Number of PWM Channels: 6; Number of Timers/Counters: 3; Oscillator Type: Internal; Peripherals: Brown-out Detect/Reset, POR, PWM, WDT; RAM Size: 2kB; Watchdog Timer: Yes; Supplier: Farnell; Supplier Part Number: ATMEGA328P-AU; Manufacturer Part Number: ATMEGA328P-AU; RoHS: Compliant; Category: Microcontrollers; Stock: 115019; Pricing: 1=2,31, 25=2,12, 100=1,91, 250=1,87 (EUR); Projected EOL Date: 2039-11-04; Case/Package: TQFP; Country of Assembly: Thailand; Country of Fabrication: United States of America; Country of Origin: Thailand; Export Control Classification Number (ECCN) Code: EAR99; Frequency: 20MHz; Height: 1.2mm; HS Code: 8542.31.0015; Harmonized Tariff Schedule (HTS) Code: 8542.31.0015; Lead Free: Lead Free; Length: 7mm; Lifecycle Status: Production; Clock Frequency: 20MHz; Max Operating Temperature: 85°C; Min Operating Temperature: -55°C; Mounting Technology: Surface Mount; Number of I2C Channels: 1; Pins: 32; Number of Programmable I/O: 23; Number of SPI Channels: 1; Number of UART Channels: 1; Radiation Hardening: No; REACH SVHC: No; Schedule B: 8542310000, 8542310000|8542310000|8542310000|8542310000|8542310000; Width: 7mm; ComponentLink1URL: https://datasheet.octopart.com:443/ATMEGA328P-AU-Microchip-datasheet-147334532.pdf?src-supplier=Microchip; ComponentLink1Description: https://datasheet.octopart.com:443/ATMEGA328P-AU-Microchip-datasheet-147334532.pdf?src-supplier=Microchip; ComponentLink2URL: https://datasheet.octopart.com:443/ATMEGA328P-AU-Microchip-datasheet-148646239.pdf?src-supplier=Microchip; ComponentLink2Description: https://datasheet.octopart.com:443/ATMEGA328P-AU-Microchip-datasheet-148646239.pdf?src-supplier=Microchip; ComponentLink3URL: https://datasheet.octopart.com:443/ATMEGA328P-AU-Microchip-datasheet-68295846.pdf?src-supplier=SHENGYU+ELECTRONICS; ComponentLink3Description: https://datasheet.octopart.com:443/ATMEGA328P-AU-Microchip-datasheet-68295846.pdf?src-supplier=SHENGYU+ELECTRONICS; ComponentLink4URL: https://datasheet.octopart.com:443/ATMEGA328P-AU-Microchip-datasheet-133520744.pdf?src-supplier=LKR; ComponentLink4Description: https://datasheet.octopart.com:443/ATMEGA328P-AU-Microchip-datasheet-133520744.pdf?src-supplier=LKR; ComponentLink5URL: https://datasheet.octopart.com:443/ATMEGA328P-AU-Microchip-datasheet-100453898.pdf?src-supplier=Upverter; ComponentLink5Description: https://datasheet.octopart.com:443/ATMEGA328P-AU-Microchip-datasheet-100453898.pdf?src-supplier=Upverter; ComponentLink6URL: https://sigma.octopart.com:443/138797047/technical_drawing/Microchip-ATMEGA328P-AU.pdf?src-supplier=Upverter; ComponentLink6Description: https://sigma.octopart.com:443/138797047/technical_drawing/Microchip-ATMEGA328P-AU.pdf?src-supplier=Upverter; ComponentLink7URL: https://datasheet.octopart.com:443/ATMEGA328P-AU-Microchip-datasheet-34147914.pdf?src-supplier=Upverter; ComponentLink7Description: https://datasheet.octopart.com:443/ATMEGA328P-AU-Microchip-datasheet-34147914.pdf?src-supplier=Upverter; ComponentLink8URL: https://datasheet.octopart.com:443/ATMEGA328P-AU-Atmel-datasheet-10629940.pdf?src-supplier=Upverter; ComponentLink8Description: https://datasheet.octopart.com:443/ATMEGA328P-AU-Atmel-datasheet-10629940.pdf?src-supplier=Upverter; ComponentLink9URL: https://datasheet.octopart.com:443/ATMEGA328P-AU-Microchip-datasheet-62316222.pdf?src-supplier=element14+APAC; ComponentLink9Description: https://datasheet.octopart.com:443/ATMEGA328P-AU-Microchip-datasheet-62316222.pdf?src-supplier=element14+APAC; ComponentLink10URL: https://datasheet.octopart.com:443/ATMEGA328P-AU-Microchip-datasheet-14421303.pdf?src-supplier=element14+APAC; ComponentLink10Description: https://datasheet.octopart.com:443/ATMEGA328P-AU-Microchip-datasheet-14421303.pdf?src-supplier=element14+APAC; ComponentLink11URL: https://datasheet.octopart.com:443/ATMEGA328P-AU-Microchip-datasheet-154741723.pdf?src-supplier=Electro+Sonic; ComponentLink11Description: https://datasheet.octopart.com:443/ATMEGA328P-AU-Microchip-datasheet-154741723.pdf?src-supplier=Electro+Sonic; ComponentLink12URL: https://datasheet.octopart.com:443/ATMEGA328P-AU-Atmel-datasheet-13381135.pdf?src-supplier=_legacy+Avnet; ComponentLink12Description: https://datasheet.octopart.com:443/ATMEGA328P-AU-Atmel-datasheet-13381135.pdf?src-supplier=_legacy+Avnet; ComponentLink13URL: https://datasheet.octopart.com:443/ATMEGA328P-AU-Atmel-datasheet-30457899.pdf?src-supplier=Seeed+Studio; ComponentLink13Description: https://datasheet.octopart.com:443/ATMEGA328P-AU-Atmel-datasheet-30457899.pdf?src-supplier=Seeed+Studio; ComponentLink14URL: https://datasheet.octopart.com:443/ATMEGA328P-AU-Atmel-datasheet-8733641.pdf?src-supplier=element14; ComponentLink14Description: https://datasheet.octopart.com:443/ATMEGA328P-AU-Atmel-datasheet-8733641.pdf?src-supplier=element14; ComponentLink15URL: https://datasheet.octopart.com:443/ATMEGA328P-AU-Atmel-datasheet-8700178.pdf?src-supplier=element14; ComponentLink15Description: https://datasheet.octopart.com:443/ATMEGA328P-AU-Atmel-datasheet-8700178.pdf?src-supplier=element14; ComponentLink16URL: https://datasheet.octopart.com:443/ATMEGA328P-AU-Atmel-datasheet-10389530.pdf?src-supplier=Newark; ComponentLink16Description: https://datasheet.octopart.com:443/ATMEGA328P-AU-Atmel-datasheet-10389530.pdf?src-supplier=Newark; ComponentLink17URL: https://datasheet.octopart.com:443/ATMEGA328P-AU-Microchip-datasheet-65729177.pdf?src-supplier=TME; ComponentLink17Description: https://datasheet.octopart.com:443/ATMEGA328P-AU-Microchip-datasheet-65729177.pdf?src-supplier=TME; ComponentLink18URL: https://datasheet.octopart.com:443/ATMEGA328P-AU-Microchip-datasheet-101746195.pdf?src-supplier=Future+Electronics; ComponentLink18Description: https://datasheet.octopart.com:443/ATMEGA328P-AU-Microchip-datasheet-101746195.pdf?src-supplier=Future+Electronics; ComponentLink19URL: http://sigma.octopart.com:80/188450247/materials_sheet/Microchip-ATMEGA328P-AU.pdf?src-supplier=Compliance+Statements; ComponentLink19Description: http://sigma.octopart.com:80/188450247/materials_sheet/Microchip-ATMEGA328P-AU.pdf?src-supplier=Compliance+Statements; ComponentLink20URL: http://sigma.octopart.com:80/rohs_statement/Microchip-company-71.pdf?src-supplier=Compliance+Statements; ComponentLink20Description: http://sigma.octopart.com:80/rohs_statement/Microchip-company-71.pdf?src-supplier=Compliance+Statements; ComponentLink21URL: http://sigma.octopart.com:80/reach_statement/Microchip-company-70.pdf?src-supplier=Compliance+Statements; ComponentLink21Description: http://sigma.octopart.com:80/reach_statement/Microchip-company-70.pdf?src-supplier=Compliance+Statements; ComponentLink22URL: http://sigma.octopart.com:80/conflict_mineral_statement/Microchip-company-69.pdf?src-supplier=Compliance+Statements; ComponentLink22Description: http://sigma.octopart.com:80/conflict_mineral_statement/Microchip-company-69.pdf?src-supplier=Compliance+Statements; ComponentLink23URL: http://sigma.octopart.com:80/conflict_mineral_statement/Microchip-company-68.pdf?src-supplier=Compliance+Statements; ComponentLink23Description: http://sigma.octopart.com:80/conflict_mineral_statement/Microchip-company-68.pdf?src-supplier=Compliance+Statements; ComponentLink24URL: http://sigma.octopart.com:80/reach_statement/Atmel-company-6.pdf?src-supplier=Compliance+Statements; ComponentLink24Description: http://sigma.octopart.com:80/reach_statement/Atmel-company-6.pdf?src-supplier=Compliance+Statements; ComponentLink25URL: http://sigma.octopart.com:80/rohs_statement/Atmel-company-5.pdf?src-supplier=Compliance+Statements; ComponentLink25Description: http://sigma.octopart.com:80/rohs_statement/Atmel-company-5.pdf?src-supplier=Compliance+Statements; ComponentLink26URL: http://sigma.octopart.com:80/rohs_statement/Atmel-company-4.pdf?src-supplier=Compliance+Statements; ComponentLink26Description: http://sigma.octopart.com:80/rohs_statement/Atmel-company-4.pdf?src-supplier=Compliance+Statements